# EAGLE design carteProto - copie (EAGLE 6.1)
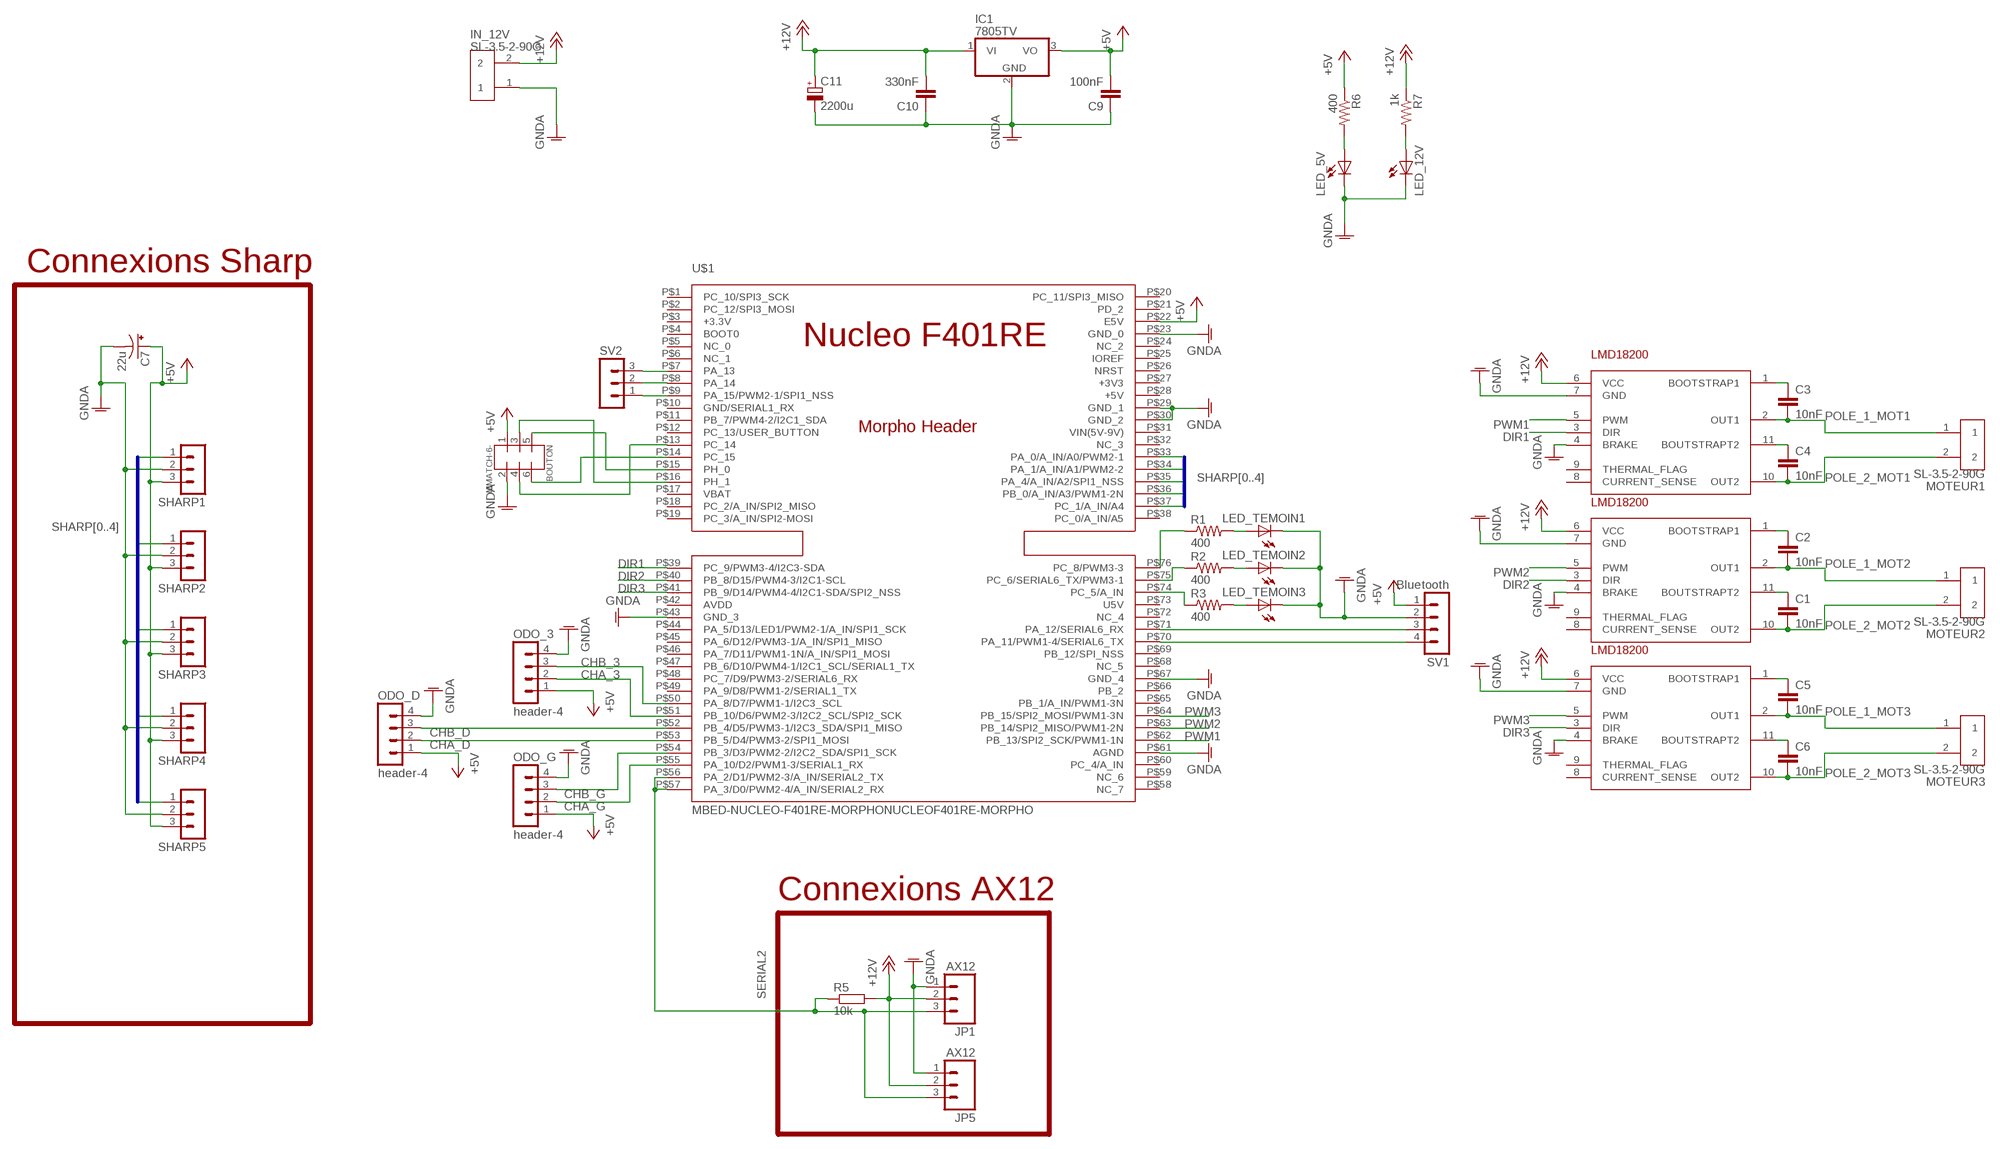
[diagram p0: schematic, sheet 1]

## Parts
BOUTON  MMATCH-6-  [AMP-215079-6]
C1  10nF  C-EUC0805  [C0805]
C2  10nF  C-EUC0805  [C0805]
C3  10nF  C-EUC0805  [C0805]
C4  10nF  C-EUC0805  [C0805]
C5  10nF  C-EUC0805  [C0805]
C6  10nF  C-EUC0805  [C0805]
C7  22u  CAP_POLPTH1  [CPOL-RADIAL-100UF-25V]
C9  100nF  C-EUC0805  [C0805]
C10  330nF  C-EUC0805  [C0805]
C11  2200u  CPOL-EUTT5D11  [TT5D11]
IC1  7805TV  [TO220V]
IN_12V  SL-3.5-2-90G  [SL-3.5-2-90G]
JP1  AX12  M03POLAR  [MOLEX-1X3]
JP5  AX12  M03POLAR  [MOLEX-1X3]
LED_5V  LEDCHIPLED_0805  [CHIPLED_0805]
LED_12V  LEDCHIPLED_0805  [CHIPLED_0805]
LED_TEMOIN1  LEDCHIPLED_0805  [CHIPLED_0805]
LED_TEMOIN2  LEDCHIPLED_0805  [CHIPLED_0805]
LED_TEMOIN3  LEDCHIPLED_0805  [CHIPLED_0805]
MOTEUR1  SL-3.5-2-90G  [SL-3.5-2-90G]
MOTEUR2  SL-3.5-2-90G  [SL-3.5-2-90G]
MOTEUR3  SL-3.5-2-90G  [SL-3.5-2-90G]
ODO_3  header-4  MA04-1  [MA04-1]
ODO_D  header-4  MA04-1  [MA04-1]
ODO_G  header-4  MA04-1  [MA04-1]
R1  400  RESISTOR0805-RES  [0805]
R2  400  RESISTOR0805-RES  [0805]
R3  400  RESISTOR0805-RES  [0805]
R5  10k  R-EU_M0805  [M0805]
R6  400  RESISTOR0805-RES  [0805]
R7  1k  RESISTOR0805-RES  [0805]
SHARP1  MA03-1  [MA03-1]
SHARP2  MA03-1  [MA03-1]
SHARP3  MA03-1  [MA03-1]
SHARP4  MA03-1  [MA03-1]
SHARP5  MA03-1  [MA03-1]
SV1  Bluetooth  MA04-1  [MA04-1]
SV2  MA03-1  [MA03-1]
U$1  MBED-NUCLEO-F401RE-MORPHONUCLEOF401RE-MORPHO  [MORPHO-HEADERS]
U$2  LMD18200  [LMD18200]
U$3  LMD18200  [LMD18200]
U$4  LMD18200  [LMD18200]

## Nets
+5V: BOUTON.1 C7.1(+) C9.2 IC1.3(VO) ODO_3.1 ODO_D.1 ODO_G.1 R6.1 SHARP1.3 SHARP2.3 SHARP3.3 SHARP4.3 SHARP5.3 SV1.1 U$1.P$22(E5V)
+12V: C10.2 C11.+ IC1.1(VI) IN_12V.2 JP1.2 JP5.2 R5.2 R7.1 U$2.6(VCC) U$3.6(VCC) U$4.6(VCC)
CHA_3: ODO_3.2 U$1.P$51(PB_10/D6/PWM2-3/I2C2_SCL/SPI2_SCK)
CHA_D: ODO_D.2 U$1.P$53(PB_5/D4/PWM3-2/SPI1_MOSI)
CHA_G: ODO_G.2 U$1.P$55(PA_10/D2/PWM1-3/SERIAL1_RX)
CHB_3: ODO_3.3 U$1.P$50(PA_8/D7/PWM1-1/I2C3_SCL)
CHB_D: ODO_D.3 U$1.P$52(PB_4/D5/PWM3-1/I2C3_SDA/SPI1_MISO)
CHB_G: ODO_G.3 U$1.P$54(PB_3/D3/PWM2-2/I2C2_SDA/SPI1_SCK)
DIR1: U$1.P$39(PC_9/PWM3-4/I2C3-SDA) U$2.3(DIR)
DIR2: U$1.P$40(PB_8/D15/PWM4-3/I2C1-SCL) U$3.3(DIR)
DIR3: U$1.P$41(PB_9/D14/PWM4-4/I2C1-SDA/SPI2_NSS) U$4.3(DIR)
GNDA: BOUTON.2 C7.2(-) C9.1 C10.1 C11.- IC1.2(GND) IN_12V.1 JP1.1 JP5.1 LED_5V.C LED_12V.C LED_TEMOIN1.C LED_TEMOIN2.C LED_TEMOIN3.C ODO_3.4 ODO_D.4 ODO_G.4 SHARP1.2 SHARP2.2 SHARP3.2 SHARP4.2 SHARP5.2 SV1.2 U$1.P$23(GND_0) U$1.P$29(GND_1) U$1.P$30(GND_2) U$1.P$43(GND_3) U$1.P$61(AGND) U$1.P$67(GND_4) U$2.4(BRAKE) U$2.7(GND) U$3.4(BRAKE) U$3.7(GND) U$4.4(BRAKE) U$4.7(GND)
N$1: C1.1 U$3.11(BOUTSTRAPT2)
N$2: C5.1 U$4.1(BOOTSTRAP1)
N$3: C2.1 U$3.1(BOOTSTRAP1)
N$4: C6.1 U$4.11(BOUTSTRAPT2)
N$5: C3.1 U$2.1(BOOTSTRAP1)
N$6: SV1.3 U$1.P$71(PA_12/SERIAL6_RX)
N$7: C4.1 U$2.11(BOUTSTRAPT2)
N$8: SV1.4 U$1.P$70(PA_11/PWM1-4/SERIAL6_TX)
N$9: LED_5V.A R6.2
N$10: LED_TEMOIN3.A R3.2
N$11: LED_12V.A R7.2
N$12: R1.1 U$1.P$76(PC_8/PWM3-3)
N$13: R2.1 U$1.P$75(PC_6/SERIAL6_TX/PWM3-1)
N$14: R3.1 U$1.P$74(PC_5/A_IN)
N$15: LED_TEMOIN1.A R1.2
N$16: LED_TEMOIN2.A R2.2
N$17: BOUTON.3 U$1.P$16(PH_1)
N$18: BOUTON.5 U$1.P$15(PH_0)
N$19: BOUTON.6 U$1.P$14(PC_15)
N$20: BOUTON.4 U$1.P$13(PC_14)
N$21: SV2.3 U$1.P$7(PA_13)
N$22: SV2.2 U$1.P$8(PA_14)
N$23: SV2.1 U$1.P$9(PA_15/PWM2-1/SPI1_NSS)
POLE_1_MOT1: C3.2 MOTEUR1.1 U$2.2(OUT1)
POLE_1_MOT2: C2.2 MOTEUR2.1 U$3.2(OUT1)
POLE_1_MOT3: C5.2 MOTEUR3.1 U$4.2(OUT1)
POLE_2_MOT1: C4.2 MOTEUR1.2 U$2.10(OUT2)
POLE_2_MOT2: C1.2 MOTEUR2.2 U$3.10(OUT2)
POLE_2_MOT3: C6.2 MOTEUR3.2 U$4.10(OUT2)
PWM1: U$1.P$62(PB_13/SPI2_SCK/PWM1-1N) U$2.5(PWM)
PWM2: U$1.P$63(PB_14/SPI2_MISO/PWM1-2N) U$3.5(PWM)
PWM3: U$1.P$64(PB_15/SPI2_MOSI/PWM1-3N) U$4.5(PWM)
SERIAL2: JP1.3 JP5.3 R5.1 U$1.P$56(PA_2/D1/PWM2-3/A_IN/SERIAL2_TX) U$1.P$57(PA_3/D0/PWM2-4/A_IN/SERIAL2_RX)
SHARP0: SHARP1.1 U$1.P$33(PA_0/A_IN/A0/PWM2-1)
SHARP1: SHARP2.1 U$1.P$34(PA_1/A_IN/A1/PWM2-2)
SHARP2: SHARP3.1 U$1.P$35(PA_4/A_IN/A2/SPI1_NSS)
SHARP3: SHARP4.1 U$1.P$36(PB_0/A_IN/A3/PWM1-2N)
SHARP4: SHARP5.1 U$1.P$37(PC_1/A_IN/A4)
Unconnected: U$1.P$1(PC_10/SPI3_SCK) U$1.P$2(PC_12/SPI3_MOSI) U$1.P$3(+3.3V) U$1.P$4(BOOT0) U$1.P$5(NC_0) U$1.P$6(NC_1) U$1.P$10(GND/SERIAL1_RX) U$1.P$11(PB_7/PWM4-2/I2C1_SDA) U$1.P$12(PC_13/USER_BUTTON) U$1.P$17(VBAT) U$1.P$18(PC_2/A_IN/SPI2_MISO) U$1.P$19(PC_3/A_IN/SPI2-MOSI) U$1.P$20(PC_11/SPI3_MISO) U$1.P$21(PD_2) U$1.P$24(NC_2) U$1.P$25(IOREF) U$1.P$26(NRST) U$1.P$27(+3V3) U$1.P$28(+5V) U$1.P$31(VIN(5V-9V)) U$1.P$32(NC_3) U$1.P$38(PC_0/A_IN/A5) U$1.P$42(AVDD) U$1.P$44(PA_5/D13/LED1/PWM2-1/A_IN/SPI1_SCK) U$1.P$45(PA_6/D12/PWM3-1/A_IN/SPI1_MISO) U$1.P$46(PA_7/D11/PWM1-1N/A_IN/SPI1_MOSI) U$1.P$47(PB_6/D10/PWM4-1/I2C1_SCL/SERIAL1_TX) U$1.P$48(PC_7/D9/PWM3-2/SERIAL6_RX) U$1.P$49(PA_9/D8/PWM1-2/SERIAL1_TX) U$1.P$58(NC_7) U$1.P$59(NC_6) U$1.P$60(PC_4/A_IN) U$1.P$65(PB_1/A_IN/PWM1-3N) U$1.P$66(PB_2) U$1.P$68(NC_5) U$1.P$69(PB_12/SPI_NSS) U$1.P$72(NC_4) U$1.P$73(U5V) U$2.8(CURRENT_SENSE) U$2.9(THERMAL_FLAG) U$3.8(CURRENT_SENSE) U$3.9(THERMAL_FLAG) U$4.8(CURRENT_SENSE) U$4.9(THERMAL_FLAG)

## Buses
SHARP[0..4]

## Notes on the sheet
- Connexions Sharp
- Connexions AX12

## Library data of the parts
BOUTON = jt-con-micromatch:MMATCH-6-*
C1-C6 C9 C10 = rcl:C-EU: CAPACITOR, European symbol
C7 = SparkFun-Capacitors:CAP_POL: Capacitor Polarized These are standard SMD and PTH capacitors. Normally 10uF, 47uF, and 100uF in electrolytic and tantalum varieties. Always verify the external diameter of the through hole cap, it varies with capacity, voltage, and manufacturer. The EIA devices should be standard.
C11 = rcl:CPOL-EU: POLARIZED CAPACITOR, European symbol
IC1 = linear:78*: Positive VOLTAGE REGULATOR Source: http://cache.national.com/ds/LM/LM78L05.pdf http://www.fairchildsemi.com/ds/LM/LM7805.pdf
IN_12V MOTEUR1-MOTEUR3 = WEIDMULLER:SL-3.5-2-90G
JP1 JP5 = SparkFun-Connectors:M03: Header 3 Standard 3-pin 0.1" header. Use with straight break away headers (SKU : PRT-00116), right angle break away headers (PRT-00553), swiss pins (PRT-00743), machine pins (PRT-00117), and female headers (PRT-00115). Molex polarized connector foot print use with SKU : PRT-08232 with associated crimp pins and housings.
LED_5V LED_12V LED_TEMOIN1-LED_TEMOIN3 = adafruit:LED: LED OSRAM: - CHIPLED LG R971, LG N971, LY N971, LG Q971, LY Q971, LO R971, LY R971 LH N974, LH R974 LS Q976, LO Q976, LY Q976 LO Q996 - Hyper CHIPLED LW Q18S LB Q993, LB Q99A, LB R99A - SideLED LS A670, LO A670, LY A670, LG A670, LP A670 LB A673, LV A673, LT A673, LW A673 LH A674 LY A675 LS A676, LA A676, LO A676, LY A676, LW A676 LS A679, LY A679, LG A679 - Hyper Micro SIDELED® LS Y876, LA Y876, LO Y876, LY Y876 LT Y87S - SmartLED LW L88C, LW L88S LB L89C, LB L89S, LG L890 LS L89K, LO L89K, LY L89K LS L896, LA L896, LO L896, LY L896 - TOPLED LS T670, LO T670, LY T670, LG T670, LP T670 LSG T670, LSP T670, LSY T670, LOP T670, LYG T670 LG T671, LOG T671, LSG T671 LB T673, LV T673, LT T673, LW T673 LH T674 LS T676, LA T676, LO T676, LY T676, LB T676, LH T676, LSB T676, LW T676 LB T67C, LV T67C, LT T67C, LS T67K, LO T67K, LY T67K, LW E67C LS E67B, LA E67B, LO E67B, LY E67B, LB E67C, LV E67C, LT E67C LW T67C LS T679, LY T679, LG T679 LS T770, LO T770, LY T770, LG T770, LP T770 LB T773, LV T773, LT T773, LW T773 LH T774 LS E675, LA E675, LY E675, LS T675 LS T776, LA T776, LO T776, LY T776, LB T776 LHGB T686 LT T68C, LB T68C - Hyper Mini TOPLED® LB M676 - Mini TOPLED Santana® LG M470 LS M47K, LO M47K, LY M47K Source: http://www.osram.convergy.de/
ODO_3 ODO_D ODO_G SV1 = con-lstb:MA04-1: PIN HEADER; OC_FARNELL: unknown; OC_NEWARK: unknown
R1-R3 R6 R7 = SparkFun-Passives:RESISTOR: Resistor Basic schematic elements and footprints for 0603, 1206, and PTH resistors.; OC_FARNELL: unknown
R5 = rcl:R-EU_: RESISTOR, European symbol
SHARP1-SHARP5 SV2 = con-lstb:MA03-1: PIN HEADER; OC_FARNELL: unknown; OC_NEWARK: unknown
U$1 = mbed-nucleo:MBED-NUCLEO-F401RE-MORPHO
U$2-U$4 = texas:LMD18200

## Board
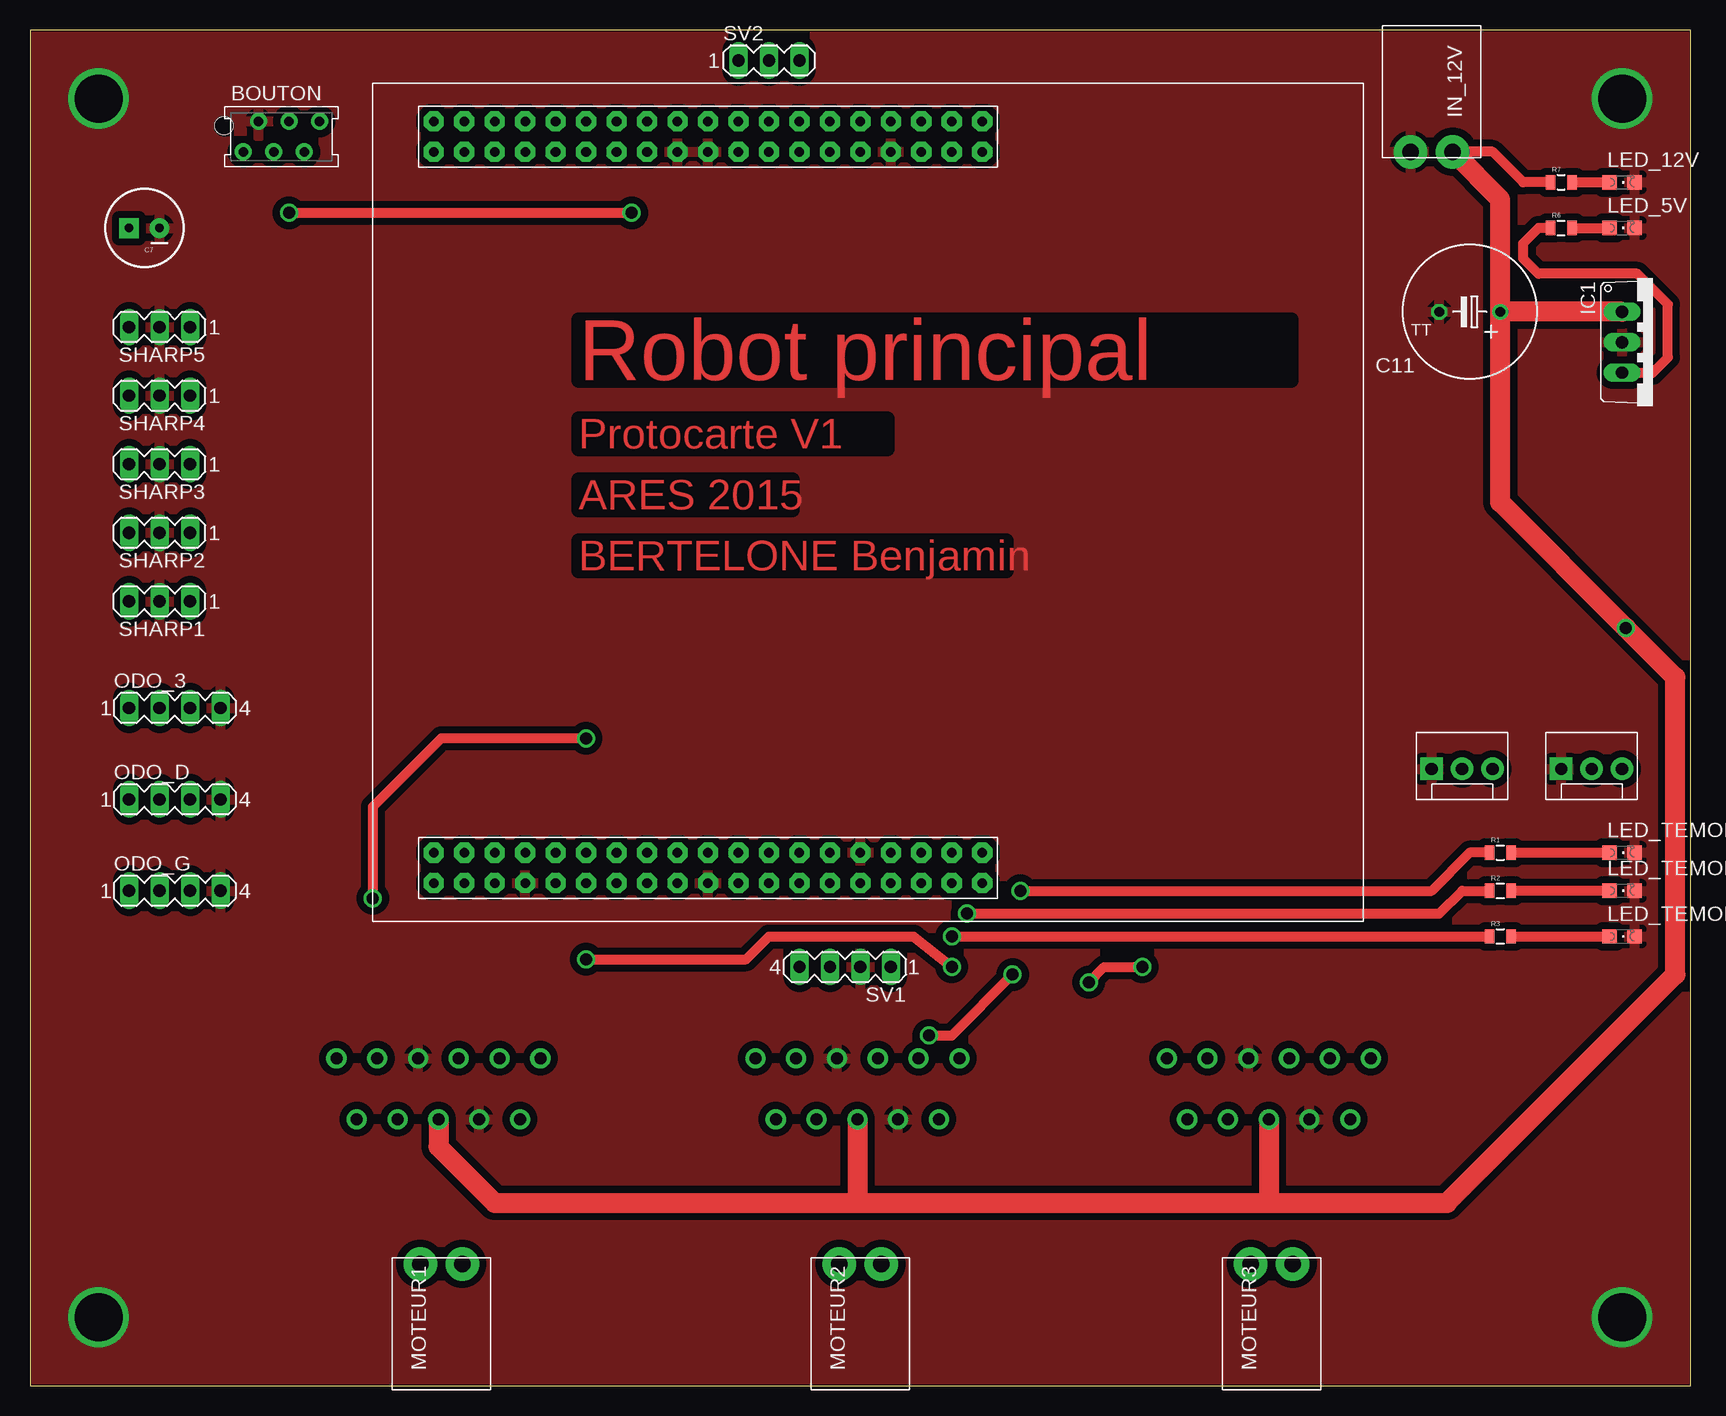
[diagram p1: board, top side]
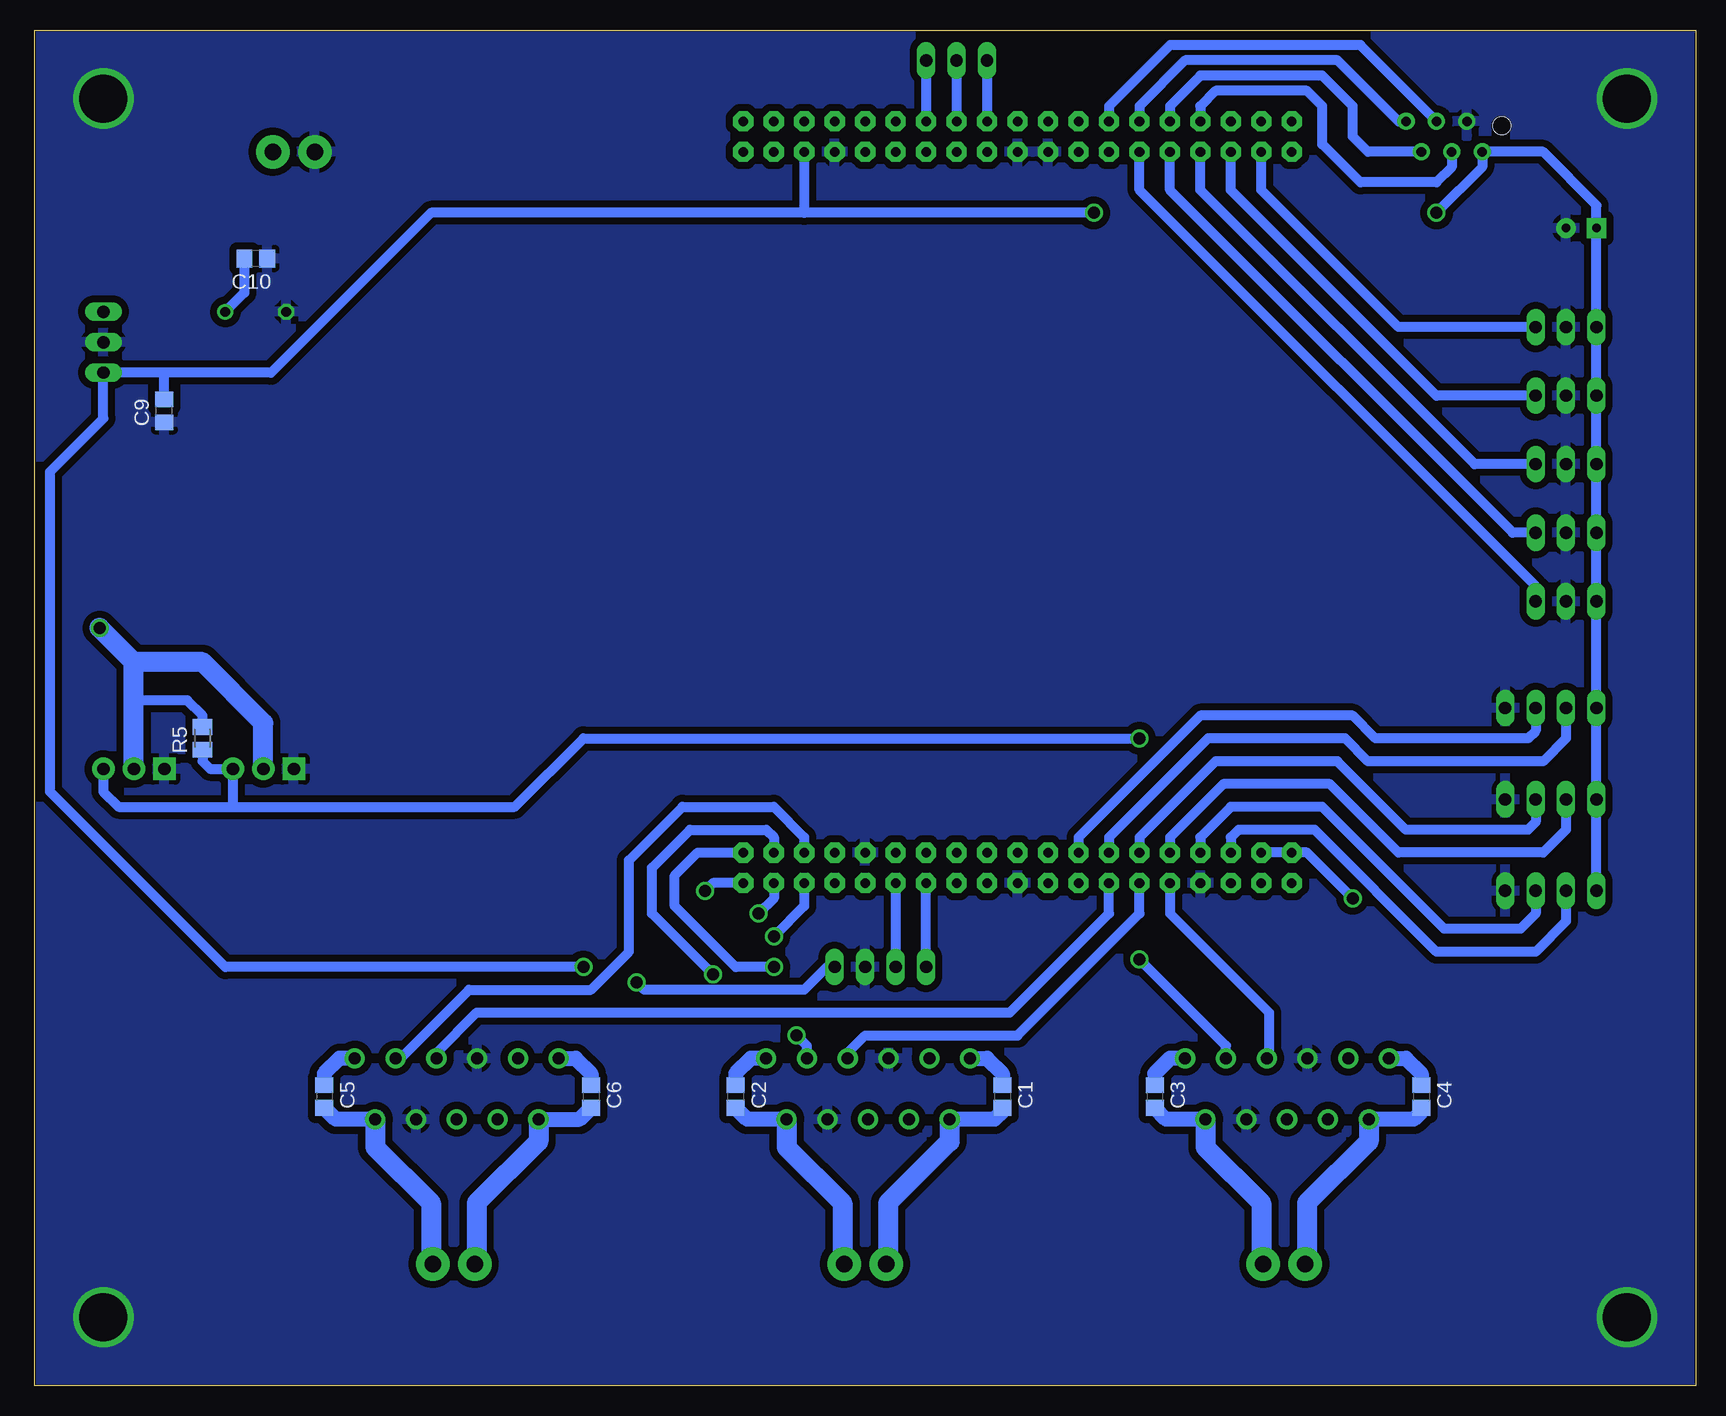
[diagram p2: board, bottom side, seen from below]

Size 138.43 x 113.03 mm. Coordinates in mm from the lower left corner, seen from the top.
Outline: 0,0 138.43,0 138.43,113.03 0,113.03 0,0
Copper layers (1*16): Top 0.035mm / dielectric 1.5mm / Bottom 0.035mm
Design rules: minimum track width 0.6mm, minimum drill 0.6mm, track to track 0.6mm, track to pad 0.6mm, pad to pad 0.6mm, via to via 0.6mm, smd to smd 0.6mm, copper to edge 4mil, drill to drill 1mm, minimum pad ring 10mil, minimum via ring 8mil, stop-mask expansion 4mil, vias tented up to drill 0mil, thermal gap 15mil

### Footprints (pad centres in the part's own frame; a part is rotated, then mirrored left to right if it is on the bottom)
AMP-215079-6 = drill 0.8 pad 1.422: 1 0,0; 2 1.27,2.54; 3 2.54,0; 4 3.81,2.54; 5 5.08,0; 6 6.35,2.54 | hole 1.5: -1.62,2.175
C0805 = smd 1.3 x 1.5: 1 -0.95,0; 2 0.95,0
CPOL-RADIAL-100UF-25V = drill 0.7 pad 1.651 square: 1 1.27,0 | drill 0.7 pad 1.651: 2 -1.27,0
TT5D11 = drill 0.813: + -2.54,0 | drill 0.813 octagon: - 2.54,0
TO220V = drill 1.016 long: 1 -2.54,-2.54; 2 0,-2.54; 3 2.54,-2.54
SL-3.5-2-90G = drill 1.4 pad 2.8: 1 0,-1.75; 2 0,1.75
MOLEX-1X3 = drill 1.016 pad 1.88 square: 1 0,0 | drill 1.016 pad 1.88: 2 2.54,0; 3 5.08,0
CHIPLED_0805 = smd 1.2 x 1.2: A 0,-1.05; C 0,1.05
MA04-1 = drill 1.016 long: 1 -3.81,0; 2 -1.27,0; 3 1.27,0; 4 3.81,0
0805 = smd 0.8 x 1.2: 1 -0.9,0; 2 0.9,0
M0805 = smd 1.3 x 1.6: 1 -0.95,0; 2 0.95,0
MA03-1 = drill 1.016 long: 1 -2.54,0; 2 0,0; 3 2.54,0
MORPHO-HEADERS = drill 0.8 pad 1.676 octagon: P$1 -31.75,15.875; P$2 -31.75,13.335; P$3 -31.75,10.795; P$4 -31.75,8.255; P$5 -31.75,5.715; P$6 -31.75,3.175; P$7 -31.75,0.635; P$8 -31.75,-1.905; P$9 -31.75,-4.445; P$10 -31.75,-6.985; P$11 -31.75,-9.525; P$12 -31.75,-12.065; P$13 -31.75,-14.605; P$14 -31.75,-17.145; P$15 -31.75,-19.685; P$16 -31.75,-22.225; P$17 -31.75,-24.765; P$18 -31.75,-27.305; P$19 -31.75,-29.845; P$20 -29.21,15.875; P$21 -29.21,13.335; P$22 -29.21,10.795; P$23 -29.21,8.255; P$24 -29.21,5.715; P$25 -29.21,3.175; P$26 -29.21,0.635; P$27 -29.21,-1.905; P$28 -29.21,-4.445; P$29 -29.21,-6.985; P$30 -29.21,-9.525; P$31 -29.21,-12.065; P$32 -29.21,-14.605; P$33 -29.21,-17.145; P$34 -29.21,-19.685; P$35 -29.21,-22.225; P$36 -29.21,-24.765; P$37 -29.21,-27.305; P$38 -29.21,-29.845; P$39 29.21,15.875; P$40 29.21,13.335; P$41 29.21,10.795; P$42 29.21,8.255; P$43 29.21,5.715; P$44 29.21,3.175; P$45 29.21,0.635; P$46 29.21,-1.905; P$47 29.21,-4.445; P$48 29.21,-6.985; P$49 29.21,-9.525; P$50 29.21,-12.065; P$51 29.21,-14.605; P$52 29.21,-17.145; P$53 29.21,-19.685; P$54 29.21,-22.225; P$55 29.21,-24.765; P$56 29.21,-27.305; P$57 29.21,-29.845; P$58 31.75,-29.845; P$59 31.75,-27.305; P$60 31.75,-24.765; P$61 31.75,-22.225; P$62 31.75,-19.685; P$63 31.75,-17.145; P$64 31.75,-14.605; P$65 31.75,-12.065; P$66 31.75,-9.525; P$67 31.75,-6.985; P$68 31.75,-4.445; P$69 31.75,-1.905; P$70 31.75,0.635; P$71 31.75,3.175; P$72 31.75,5.715; P$73 31.75,8.255; P$74 31.75,10.795; P$75 31.75,13.335; P$76 31.75,15.875
LMD18200 = drill 1 pad 1.676: 1 0,0; 2 1.7,5.08; 3 3.4,0; 4 5.1,5.08; 5 6.8,0; 6 8.5,5.08; 7 10.2,0; 8 11.9,5.08; 9 13.6,0; 10 15.3,5.08; 11 17,0

### Placement (x,y rotation side)
BOUTON  17.78,102.87 0 top
C1  57.78,24.13 270 bottom
C2  80.01,24.13 270 bottom
C3  45.08,24.13 270 bottom
C4  22.86,24.13 270 bottom
C5  114.3,24.13 270 bottom
C6  92.08,24.13 270 bottom
C7  9.53,96.52 180 top
C9  127.64,81.28 90 bottom
C10  120.02,93.98 180 bottom
C11  120.02,89.53 180 top
IC1  135.25,87 270 top
IN_12V  116.84,102.87 270 top
JP1  116.84,51.44 0 top
JP5  127.64,51.44 0 top
LED_5V  132.72,96.52 270 top
LED_12V  132.72,100.33 270 top
LED_TEMOIN1  132.72,44.45 270 top
LED_TEMOIN2  132.72,41.28 270 top
LED_TEMOIN3  132.72,37.47 270 top
MOTEUR1  34.29,10.16 90 top
MOTEUR2  69.22,10.16 90 top
MOTEUR3  103.51,10.16 90 top
ODO_3  12.06,56.52 0 top
ODO_D  12.06,48.89 0 top
ODO_G  12.06,41.28 0 top
R1  122.56,44.45 0 top
R2  122.56,41.28 0 top
R3  122.56,37.47 0 top
R5  124.46,53.97 90 bottom
R6  127.64,96.52 0 top
R7  127.64,100.33 0 top
SHARP1  10.79,65.41 180 top
SHARP2  10.79,71.12 180 top
SHARP3  10.79,76.84 180 top
SHARP4  10.79,82.55 180 top
SHARP5  10.79,88.27 180 top
SV1  67.94,34.92 180 top
SV2  61.59,110.49 0 top
U$1  63.5,73.66 270 top
U$2  42.55,27.3 180 top
U$3  77.47,27.3 180 top
U$4  111.76,27.3 180 top

### Tracks (layer width: path | path; a pad name or v marks a point on that pad's centre or on a via)
+5V  (via drill 1)
  Top 0.813: IC1.3 135.25,84.45 136.53,85.73 136.53,90.17 133.99,92.71 125.73,92.71 124.46,93.98 124.46,95.25 125.73,96.52 R6.1 | v21.59,97.79 v50.17,97.79 | v88.27,33.66 89.53,34.92 v92.71,34.92
  Bottom 0.813: ODO_G.1 ODO_D.1 ODO_3.1 SHARP1.3 SHARP2.3 SHARP3.3 SHARP4.3 SHARP5.3 C7.1 8.25,98.42 12.7,102.87 BOUTON.1 17.78,101.6 v21.59,97.79 | v50.17,97.79 74.3,97.79 | 74.3,97.79 105.41,97.79 118.75,84.45 127.64,84.45 | 127.64,84.45 IC1.3 132.72,80.65 137.16,76.2 137.16,49.53 122.56,34.92 v92.71,34.92 | C9.2 127.64,84.45 | U$1.P$22 74.3,97.79 | SV1.1 72.39,34.92 74.3,33.02 87.63,33.02 v88.27,33.66
+12V  (via drill 1)
  Top 0.813: R7.1 124.46,100.33 121.92,102.87 IN_12V.2
  Top 1.676: U$2.6 34.05,19.93 38.73,15.24 69.22,15.24 | 69.22,15.24 103.51,15.24 | 103.51,15.24 118.11,15.24 137.16,34.29 137.16,59.06 v133.03,63.18 122.56,73.66 C11.+ | IC1.1 C11.+ | C11.+ 122.56,98.91 IN_12V.2 | U$3.6 68.97,15.48 69.22,15.24 | U$4.6 103.26,15.48 103.51,15.24
  Bottom 0.813: R5.2 124.46,55.88 125.73,57.15 130.17,57.15 | C10.2 120.97,91.12 C11.+
  Bottom 1.676: JP5.2 130.17,57.15 130.17,60.33 | 130.17,60.33 v133.03,63.18 | JP1.2 119.38,55.25 124.46,60.33 130.17,60.33
CHA_3
  Bottom 0.813: ODO_3.2 10.79,53.97 12.7,52.07 27.3,52.07 29.21,53.97 40.64,53.97 48.89,45.72 U$1.P$51
CHA_D
  Bottom 0.813: ODO_D.2 10.79,46.36 12.7,44.45 24.77,44.45 30.48,50.17 39.37,50.17 43.81,45.72 U$1.P$53
CHA_G
  Bottom 0.813: ODO_G.2 10.79,38.73 13.34,36.2 21.59,36.2 31.75,46.36 38.1,46.36 38.73,45.72 U$1.P$55
CHB_3
  Bottom 0.813: ODO_3.3 13.34,54.61 13.97,53.97 26.67,53.97 28.57,55.88 41.28,55.88 51.44,45.72 U$1.P$50
CHB_D
  Bottom 0.813: ODO_D.3 13.34,46.99 13.97,46.36 24.13,46.36 29.84,52.07 40,52.07 46.36,45.72 U$1.P$52
CHB_G
  Bottom 0.813: ODO_G.3 13.34,39.37 14.61,38.1 20.95,38.1 31.11,48.26 38.73,48.26 41.28,45.72 U$1.P$54
DIR1  (via drill 1)
  Top 0.813: v46.36,35.56 59.69,35.56 61.59,37.47 73.66,37.47 v76.84,34.92
  Bottom 0.813: U$2.3 39.14,28.35 v46.36,35.56 | v76.84,34.92 80.01,34.92 85.09,40 85.09,42.55 83.19,44.45 U$1.P$39
DIR2  (via drill 1)
  Top 0.813: v74.93,29.21 76.84,29.21 v81.92,34.29
  Bottom 0.813: U$3.3 74.07,28.35 v74.93,29.21 | v81.92,34.29 87,39.37 87,43.18 83.82,46.36 77.47,46.36 76.84,45.72 U$1.P$40
DIR3
  Bottom 0.813: U$4.3 107.95,27.3 102.23,33.02 92.08,33.02 88.9,36.2 88.9,43.81 84.45,48.26 76.84,48.26 74.3,45.72 U$1.P$41
GNDA  (via drill 4)
  other vias: 5.71,5.71 5.71,107.31 132.72,5.71 132.72,107.31
  pour Bottom: -0.63,113.67 139.06,113.67 139.06,-0.63 -0.63,-0.63
  pour Top: -6.98,120.02 145.41,120.02 145.41,-6.98 -6.98,-6.98
N$1
  Bottom 1.27: U$3.11 59.06,27.3 57.78,26.04 C1.1
N$2
  Bottom 1.27: U$4.1 113.03,27.3 114.3,26.04 C5.1
N$3
  Bottom 1.27: U$3.1 78.74,27.3 80.01,26.04 C2.1
N$4
  Bottom 1.27: U$4.11 93.34,27.3 92.08,26.04 C6.1
N$5
  Bottom 1.27: U$2.1 43.81,27.3 45.08,26.04 C3.1
N$6
  Bottom 0.813: U$1.P$71 SV1.3
N$7
  Bottom 1.27: U$2.11 24.13,27.3 22.86,26.04 C4.1
N$8
  Bottom 0.813: SV1.4 U$1.P$70
N$9
  Top 0.813: R6.2 LED_5V.A
N$10
  Top 0.813: R3.2 LED_TEMOIN3.A
N$11
  Top 0.813: R7.2 LED_12V.A
N$12  (via drill 1)
  Top 0.813: v82.55,41.28 116.84,41.28 120.02,44.45 R1.1
  Bottom 0.813: U$1.P$76 81.92,41.91 v82.55,41.28
N$13  (via drill 1)
  Top 0.813: v78.11,39.37 117.48,39.37 119.38,41.28 R2.1
  Bottom 0.813: U$1.P$75 76.84,40.64 v78.11,39.37
N$14  (via drill 1)
  Top 0.813: v76.84,37.47 R3.1
  Bottom 0.813: U$1.P$74 74.3,40 v76.84,37.47
N$15
  Top 0.813: R1.2 LED_TEMOIN1.A
N$16
  Top 0.813: LED_TEMOIN2.A R2.2
N$17
  Bottom 0.813: BOUTON.3 20.32,101.6 21.59,100.33 27.94,100.33 31.11,103.51 31.11,106.68 32.39,107.95 40,107.95 41.28,106.68 U$1.P$16
N$18
  Bottom 0.813: BOUTON.5 27.3,102.87 28.57,104.14 28.57,106.68 31.11,109.22 41.28,109.22 43.81,106.68 U$1.P$15
N$19
  Bottom 0.813: BOUTON.6 24.77,105.41 29.84,110.49 42.55,110.49 46.36,106.68 U$1.P$14
N$20
  Bottom 0.813: BOUTON.4 27.94,111.76 43.81,111.76 48.89,106.68 U$1.P$13
N$21
  Bottom 0.813: SV2.3 U$1.P$7
N$22
  Bottom 0.813: SV2.2 U$1.P$8
N$23
  Bottom 0.813: SV2.1 U$1.P$9
POLE_1_MOT1
  Bottom 1.27: U$2.2 44.13,22.23 C3.2
  Bottom 1.676: U$2.2 40.84,19.89 36.2,15.24 36.2,10.31 MOTEUR1.1
POLE_1_MOT2
  Bottom 1.27: U$3.2 79.06,22.23 C2.2
  Bottom 1.676: U$3.2 75.77,19.89 71.12,15.24 71.12,10.31 MOTEUR2.1
POLE_1_MOT3
  Bottom 1.27: U$4.2 113.34,22.23 C5.2
  Bottom 1.676: U$4.2 110.06,19.89 105.41,15.24 105.41,10.31 MOTEUR3.1
POLE_2_MOT1
  Bottom 1.27: C4.2 22.86,22.86 23.5,22.23 U$2.10
  Bottom 1.676: U$2.10 27.25,20.38 32.39,15.24 32.39,10.31 MOTEUR1.2
POLE_2_MOT2
  Bottom 1.27: C1.2 57.78,22.86 58.42,22.23 U$3.10
  Bottom 1.676: U$3.10 62.17,20.38 67.31,15.24 67.31,10.31 MOTEUR2.2
POLE_2_MOT3
  Bottom 1.27: U$4.10 93.03,22.23 C6.2
  Bottom 1.676: U$4.10 96.46,20.38 101.6,15.24 101.6,10.31 MOTEUR3.2
PWM1
  Bottom 0.813: U$1.P$62 43.81,39.37 35.56,31.11 35.56,27.49 U$2.5
PWM2
  Bottom 0.813: U$3.5 70.67,27.75 69.22,29.21 56.52,29.21 46.36,39.37 U$1.P$63
PWM3
  Bottom 0.813: U$4.5 104.96,27.75 101.6,31.11 57.15,31.11 48.89,39.37 U$1.P$64
SERIAL2  (via drill 1)
  Top 0.813: v46.36,53.97 34.29,53.97 28.57,48.26 v28.57,40.64
  Bottom 0.813: R5.1 124.46,52.07 123.83,51.44 JP1.3 121.92,48.26 | JP5.3 132.72,49.53 131.44,48.26 121.92,48.26 | 121.92,48.26 98.42,48.26 92.71,53.97 v46.36,53.97 | v28.57,40.64 32.39,44.45 U$1.P$57 U$1.P$56
SHARP0
  Bottom 0.813: SHARP1.1 13.34,66.67 46.36,99.7 U$1.P$33
SHARP1
  Bottom 0.813: SHARP2.1 15.24,71.12 43.81,99.7 U$1.P$34
SHARP2
  Bottom 0.813: SHARP3.1 18.41,76.84 41.28,99.7 U$1.P$35
SHARP3
  Bottom 0.813: SHARP4.1 21.59,82.55 38.73,99.7 U$1.P$36
SHARP4
  Bottom 0.813: SHARP5.1 24.77,88.27 36.2,99.7 U$1.P$37

### Text on the board
Top: Robot principal | Protocarte V1 | ARES 2015 | BERTELONE Benjamin